# Altium schematic sheet Sheet1.SchDoc
size A4; SPICEModelCacheTRECTFUP: <root> / <DocumentId>TRECTFUP</DocumentId> / <CacheFrame Number="0"> / <Model Name="1n4149" Kind="MDL"> / <Text>*1N4149 MCE 3-13-97 / *Ref: National Discrete Products Databook, 1996 / *75V 10mA Si Computer Diode pkg:DIODE0.4 1,2 / .MODEL 1N4149 D (IS=14.2P RS=4.2 N=1.7 BV=75 IBV=5U / + CJO=1.74P VJ=0.75 M=0.333 TT=4.32N)</Text> / </Model> / </CacheFrame> / </root>
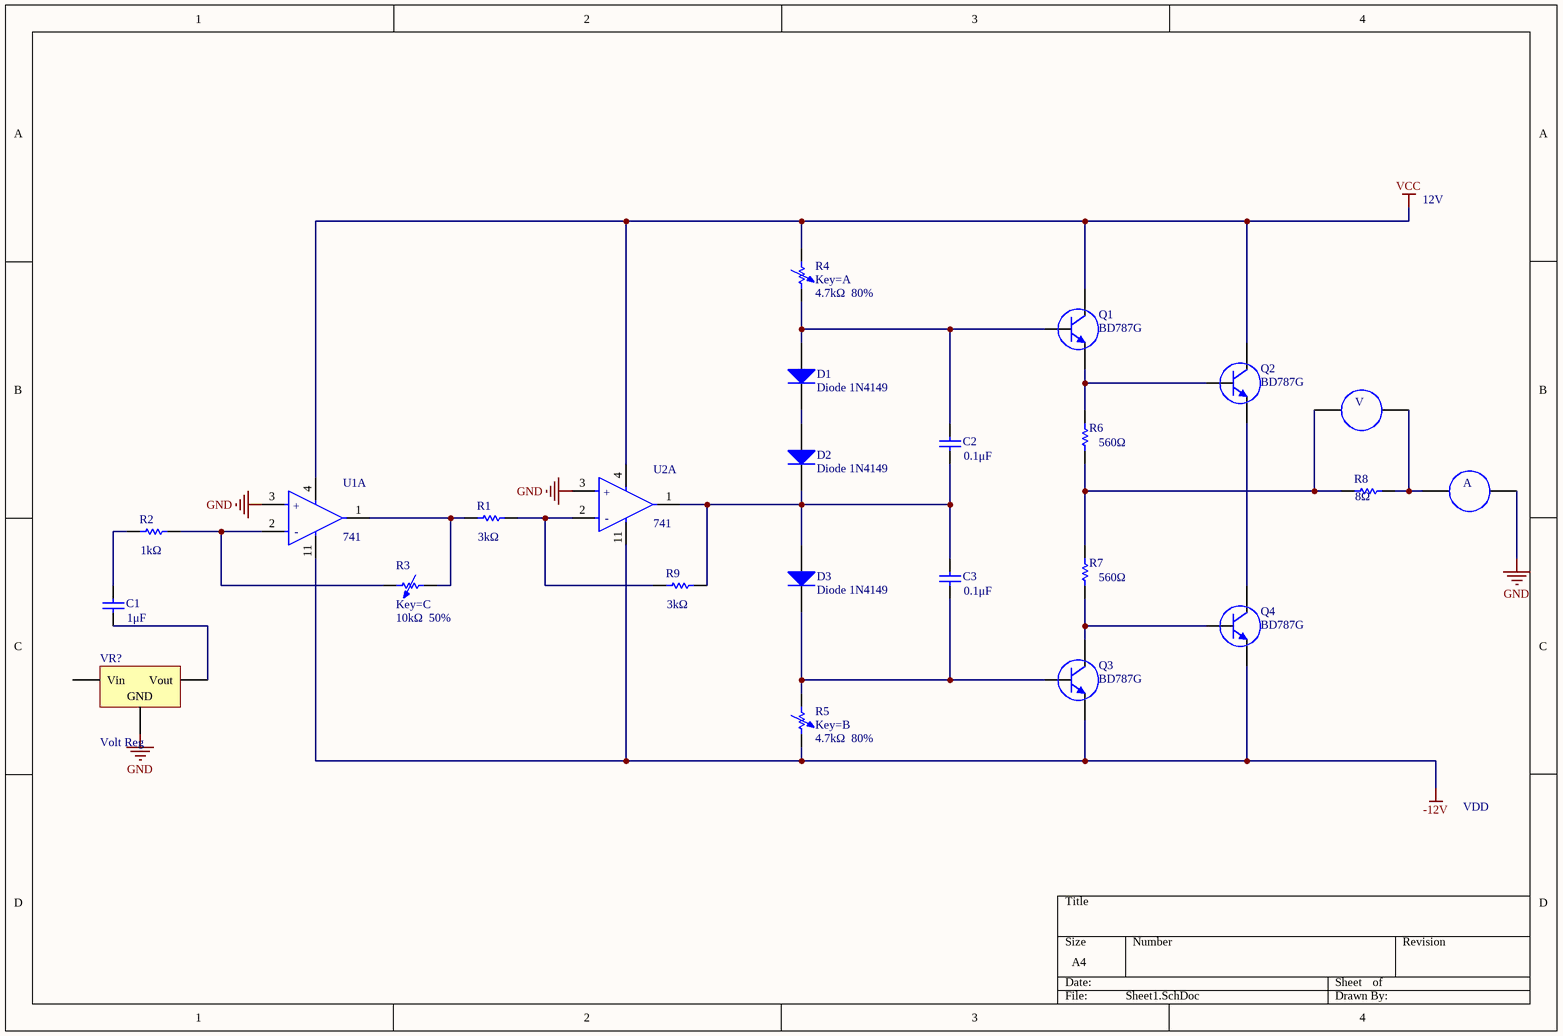
[diagram p0: Sheet1.SchDoc]

## Parts
A  Meter  [RAD-0.1]  (value not drawn)
C1  value 1μF  [RAD-0.3]
C2  value 0.1μF  [RAD-0.3]  (hidden comment: Cap)
C3  value 0.1μF  [RAD-0.3]  (hidden comment: Cap)
D1  Diode 1N4149  [DO-35A]
D2  Diode 1N4149  [DO-35A]
D3  Diode 1N4149  [DO-35A]
Q1  BD787G  [ONSC-TO-225-3-77-09]
Q2  BD787G  [ONSC-TO-225-3-77-09]
Q3  BD787G  [ONSC-TO-225-3-77-09]
Q4  BD787G  [ONSC-TO-225-3-77-09]
R1  value 3kΩ  [AXIAL-0.3]  (hidden comment: Res1)
R2  value 1kΩ  [AXIAL-0.3]
R3  Key=C  value 10kΩ  50%  [AXIAL-0.7]
R4  Key=A  value 4.7kΩ  80%  [AXIAL-0.7]
R5  Key=B  value 4.7kΩ  80%  [AXIAL-0.7]
R6  value 560Ω  [AXIAL-0.3]  (hidden comment: Res1)
R7  value 560Ω  [AXIAL-0.3]  (hidden comment: Res1)
R8  value 8Ω  [AXIAL-0.3]  (hidden comment: Res1)
R9  value 3kΩ  [AXIAL-0.3]  (hidden comment: Res1)
U1  741  [FP-N-14-MFG]  (part A of 4)
U2  741  [FP-N-14-MFG]  (part A of 4)
V  Meter  [RAD-0.1]  (value not drawn)
VR?  Volt Reg  [D2PAK_N]

## Nets
-12V: Q3.1(E) Q4.1(E) R5.2 U1.11(V-) U2.11(V-)
GND: A.2 U1.3(+IN_A) U2.3(+IN_A) VR?.2(GND)
VCC: Q1.3(C) Q2.3(C) R4.1 U1.4(V+) U2.4(V+)
NetA_1: A.1 R8.2 V.2
NetC1_1: C1.1 VR?.3(Vout)
NetC1_2: C1.2 R2.1
NetC2_1: C2.1 C3.2 D2.2(K) D3.1(A) R9.2 U2.1(OUT_A)
NetC2_2: C2.2 D1.1(A) Q1.2(B) R4.2
NetC3_1: C3.1 D3.2(K) Q3.2(B) R5.1
NetD1_2: D1.2(K) D2.1(A)
NetQ1_1: Q1.1(E) Q2.2(B) R6.2
NetQ2_1: Q2.1(E) Q4.3(C)
NetQ3_3: Q3.3(C) Q4.2(B) R7.1
NetR1_1: R1.1 R3.1 U1.1(OUT_A)
NetR1_2: R1.2 R9.1 U2.2(-IN_A)
NetR2_2: R2.2 R3.2 U1.2(-IN_A)
NetR6_1: R6.1 R7.2 R8.1 V.1

Not connected (* = marked no-connect by the designer): VR? 1(Vin)

## Notes on the sheet
- 12V
- VDD
- (in symbol CMP-09116-000067-1, part A) +

## Library data of the parts
A V = Meter: Indicating Instrument; Note: Place a "letter" into the symbol to show the function of the meter or instrument; Published: 24-Mar-1999; LatestRevisionDate: 17-Jul-2002; LatestRevisionNote: Re-released for DXP Platform.; PackageReference: RAD-0.1; Publisher: Altium Limited; PackageDescription: Radial Cap, Thru-Hole; 2 Leads; 0.1 in Pin Spacing
C1-C3 = Cap: Capacitor; Published: 8-Jun-2000; LatestRevisionDate: 17-Jul-2002; LatestRevisionNote: Re-released for DXP Platform.; PackageReference: RAD-0.3; Publisher: Altium Limited; PackageDescription: Radial Cap, Thru-Hole; 2 Leads; 0.3 in Pin Spacing
D1-D3 = Diode 1N4149: Computer Diode; Published: 8-Jun-2000; LatestRevisionDate: 17-Jul-2002; LatestRevisionNote: Re-released for DXP Platform.; DatasheetVersion: 1989; PackageVersion: 1989; PackageReference: DO-35A; Publisher: Altium Limited; PackageDescription: Diode, Axial; Body 4.6 x 1.9 mm (LxDia. max), Lead Dia. 0.53 mm (max); Code_JEDEC: DO-204-AH; ComponentLink1Description: Manufacturer Link; ComponentLink1URL: http://www.national.com/
Q1-Q4 = CMP-013-00034-1: BD Series 60 V 4 A PNP Complementary Plastic Silicon Power Transistor TO-220 AB; Frequency: 50MHz; Case/Package: TO-225-3; Max Operating Temperature: 150°C; Min Operating Temperature: -65°C; RoHS Compliant: Yes
R1 R2 R6-R9 = Res1: Resistor; Published: 8-Jun-2000; LatestRevisionDate: 17-Jul-2002; LatestRevisionNote: Re-released for DXP Platform.; PackageReference: AXIAL-0.3; Publisher: Altium Limited; PackageDescription: Axial Device, Thru-Hole; 2 Leads; 0.3 in Pin Spacing
R3-R5 = Res Adj1: Variable Resistor; Set Position: 0.5; Published: 8-Jun-2000; LatestRevisionDate: 17-Jul-2002; LatestRevisionNote: Re-released for DXP Platform.; PackageReference: AXIAL-0.7; Publisher: Altium Limited; PackageDescription: Axial Device, Thru-Hole; 2 Leads; 0.7 in Pin Spacing
U1 U2 = CMP-09116-000067-1: IC OPAMP GP 4 CIRCUIT 14DIP; Voltage Gain: 116.26dB; Power Supply Rejection Ratio (PSRR): 107.96dB; Common Mode Rejection Ratio: 100dB; Amplifier Type: GENERAL PURPOSE; Number of Amplifiers: 4; Bandwidth: 3MHz; Input Offset Voltage (Vos): 500uV; Slew Rate: 1V/µs; Max Dual Supply Voltage: 22V; Input Bias Current: 300nA; Width: 6.35mm; Max Operating Temperature: 70°C; Technology: BIPOLAR; Case/Package: PDIP; Lead Free: Contains Lead; Number of Pins: 14; RoHS Compliant: Yes; Height: 3.3mm; Radiation Hardening: No; REACH SVHC: No SVHC; Min Operating Temperature: 0°C; Mount: Through Hole; Series: -; Length: 19.05mm; Number of Circuits: 4; Number of Channels: 4; Package Quantity: 25; Packaging: Rail/Tube; Number of Elements: 4
VR? = Volt Reg: Voltage Regulator; Published: 24-Mar-1999; LatestRevisionDate: 29-May-2009; LatestRevisionNote: IPC-7351 Footprint Added.; PackageReference: D2PAK; Publisher: Altium Limited; PackageDescription: 3-Pin Transistor Outline Package 2.54 mm Pitch, 15.1 mm Lead Span